# EAGLE schematic Shield (EAGLE 9.1.0)
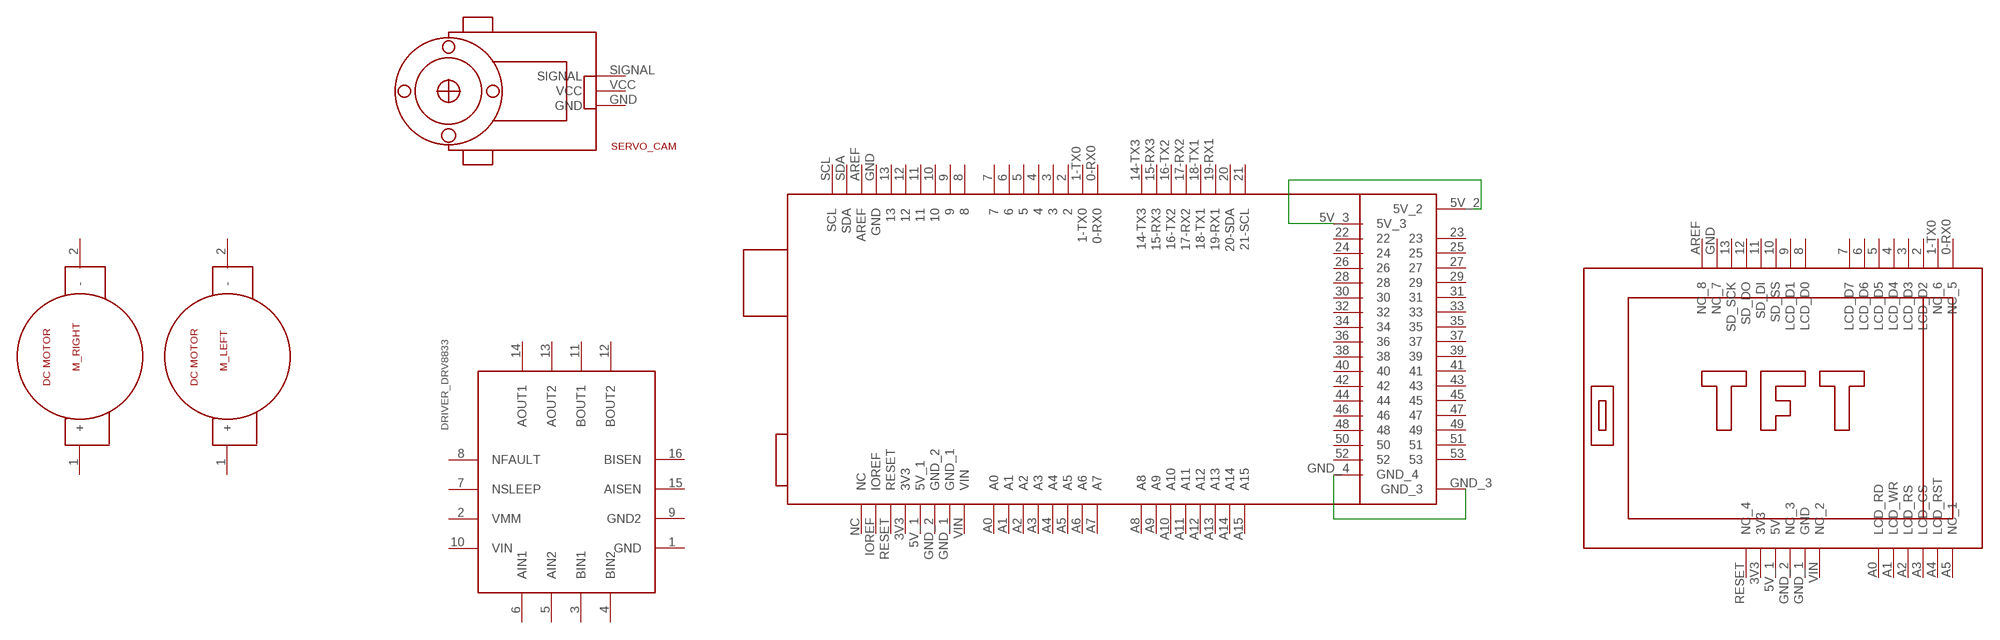
[diagram p0: schematic, sheet 1]

## Parts
DRIVER_DRV8833  MODULO  [MODULO]
M_LEFT  OUTPUTMALE  [OUPUTMALE]
M_RIGHT  OUTPUTMALE  [OUPUTMALE]
SERVO_CAM  SERVOMOTORES  [SERVO]
TFT-ARDUINO-MEGA  TFT_ARDUINO-UNO-MEGA  [TFT-ARDUINO-UNO-MEGA]
U$1  ARDUINO_MEGA  [ARDUINO-MEGA]

## Nets
N$1: U$1.5V_2 U$1.5V_3
N$2: U$1.GND_3 U$1.GND_4
Unconnected: DRIVER_DRV8833.1(GND) DRIVER_DRV8833.2(VMM) DRIVER_DRV8833.3(BIN1) DRIVER_DRV8833.4(BIN2) DRIVER_DRV8833.5(AIN2) DRIVER_DRV8833.6(AIN1) DRIVER_DRV8833.7(NSLEEP) DRIVER_DRV8833.8(NFAULT) DRIVER_DRV8833.9(GND2) DRIVER_DRV8833.10(VIN) DRIVER_DRV8833.11(BOUT1) DRIVER_DRV8833.12(BOUT2) DRIVER_DRV8833.13(AOUT2) DRIVER_DRV8833.14(AOUT1) DRIVER_DRV8833.15(AISEN) DRIVER_DRV8833.16(BISEN) M_LEFT.1(+) M_LEFT.2(-) M_RIGHT.1(+) M_RIGHT.2(-) SERVO_CAM.GND SERVO_CAM.SIGNAL SERVO_CAM.VCC TFT-ARDUINO-MEGA.0-RX0(NC_5) TFT-ARDUINO-MEGA.1-TX0(NC_6) TFT-ARDUINO-MEGA.2(LCD_D2) TFT-ARDUINO-MEGA.3(LCD_D3) TFT-ARDUINO-MEGA.3V3 TFT-ARDUINO-MEGA.4(LCD_D4) TFT-ARDUINO-MEGA.5(LCD_D5) TFT-ARDUINO-MEGA.5V_1(5V) TFT-ARDUINO-MEGA.6(LCD_D6) TFT-ARDUINO-MEGA.7(LCD_D7) TFT-ARDUINO-MEGA.8(LCD_D0) TFT-ARDUINO-MEGA.9(LCD_D1) TFT-ARDUINO-MEGA.10(SD_SS) TFT-ARDUINO-MEGA.11(SD_DI) TFT-ARDUINO-MEGA.12(SD_DO) TFT-ARDUINO-MEGA.13(SD_SCK) TFT-ARDUINO-MEGA.A0(LCD_RD) TFT-ARDUINO-MEGA.A1(LCD_WR) TFT-ARDUINO-MEGA.A2(LCD_RS) TFT-ARDUINO-MEGA.A3(LCD_CS) TFT-ARDUINO-MEGA.A4(LCD_RST) TFT-ARDUINO-MEGA.A5(NC_1) TFT-ARDUINO-MEGA.AREF(NC_8) TFT-ARDUINO-MEGA.GND(NC_7) TFT-ARDUINO-MEGA.GND_1(GND) TFT-ARDUINO-MEGA.GND_2(NC_3) TFT-ARDUINO-MEGA.RESET(NC_4) TFT-ARDUINO-MEGA.VIN(NC_2) U$1.0-RX0 U$1.1-TX0 U$1.2 U$1.3 U$1.3V3 U$1.4 U$1.5 U$1.5V_1 U$1.6 U$1.7 U$1.8 U$1.9 U$1.10 U$1.11 U$1.12 U$1.13 U$1.14-TX3 U$1.15-RX3 U$1.16-TX2 U$1.17-RX2 U$1.18-TX1 U$1.19-RX1 U$1.20(20-SDA) U$1.21(21-SCL) U$1.22 U$1.23 U$1.24 U$1.25 U$1.26 U$1.27 U$1.28 U$1.29 U$1.30 U$1.31 U$1.32 U$1.33 U$1.34 U$1.35 U$1.36 U$1.37 U$1.38 U$1.39 U$1.40 U$1.41 U$1.42 U$1.43 U$1.44 U$1.45 U$1.46 U$1.47 U$1.48 U$1.49 U$1.50 U$1.51 U$1.52 U$1.53 U$1.A0 U$1.A1 U$1.A2 U$1.A3 U$1.A4 U$1.A5 U$1.A6 U$1.A7 U$1.A8 U$1.A9 U$1.A10 U$1.A11 U$1.A12 U$1.A13 U$1.A14 U$1.A15 U$1.AREF U$1.GND U$1.GND_1 U$1.GND_2 U$1.IOREF U$1.NC U$1.RESET U$1.SCL U$1.SDA U$1.VIN

## Library data of the parts
DRIVER_DRV8833 = drv8833:MODULO: This board is very similar to our DRV8835 dual motor driver carrier in operating voltage range and continuous current rating, but the DRV8835 has a lower minimum operating voltage, offers an extra control interface mode, and is 0.1″ smaller in each dimension; we also carry a DRV8835 dual motor driver shield that is easy to use with an Arduino. The DRV8833 has a higher peak current rating (2 A per channel vs 1.5 A), optional built-in current-limiting, and no need for externally supplied logic voltage.
M_LEFT M_RIGHT = motores:OUTPUTMALE
SERVO_CAM = motores:SERVOMOTORES: Servomotor normal
TFT-ARDUINO-MEGA = TFT:TFT_ARDUINO-UNO-MEGA: Pantalla LCD TFT de 2,4” Chip controlador LCD ILI9341 (Enlace para descargar el Datasheet ILI9341) 320×240 pixeles de resolución y 262.000 colores Panel táctil resistivo de 4 hilos Compatible con tensión de 5V ya que dispone de regulador de tensión en placa Conexión Shield para Arduino UNO Tamaño: 71 x 52 x 7 mm (L x A x H)
U$1 = ArduinoMega:ARDUINO_MEGA: El Arduino MEGA 2560 está diseñado para proyectos que requieren más líneas de E / S, más memoria de boceto y más RAM. Con 54 pines de E / S digitales, 16 entradas analógicas y un espacio más grande para su boceto, es la placa recomendada para impresoras 3D y proyectos de robótica. Microcontrolador: ATmega2560 Voltaje Operativo: 5V Voltaje de Entrada: 7-12V Voltaje de Entrada(límites): 6-20V Pines digitales de Entrada/Salida: 54 (de los cuales 15 proveen salida PWM) Pines análogos de entrada: 16 Corriente DC por cada Pin Entrada/Salida: 40 mA Corriente DC entregada en el Pin 3.3V: 50 mA Memoria Flash: 256 KB (8KB usados por el bootloader) SRAM: 8KB EEPROM: 4KB Clock Speed: 16 MHz